# Altium project Akhrom V2.PrjPcb
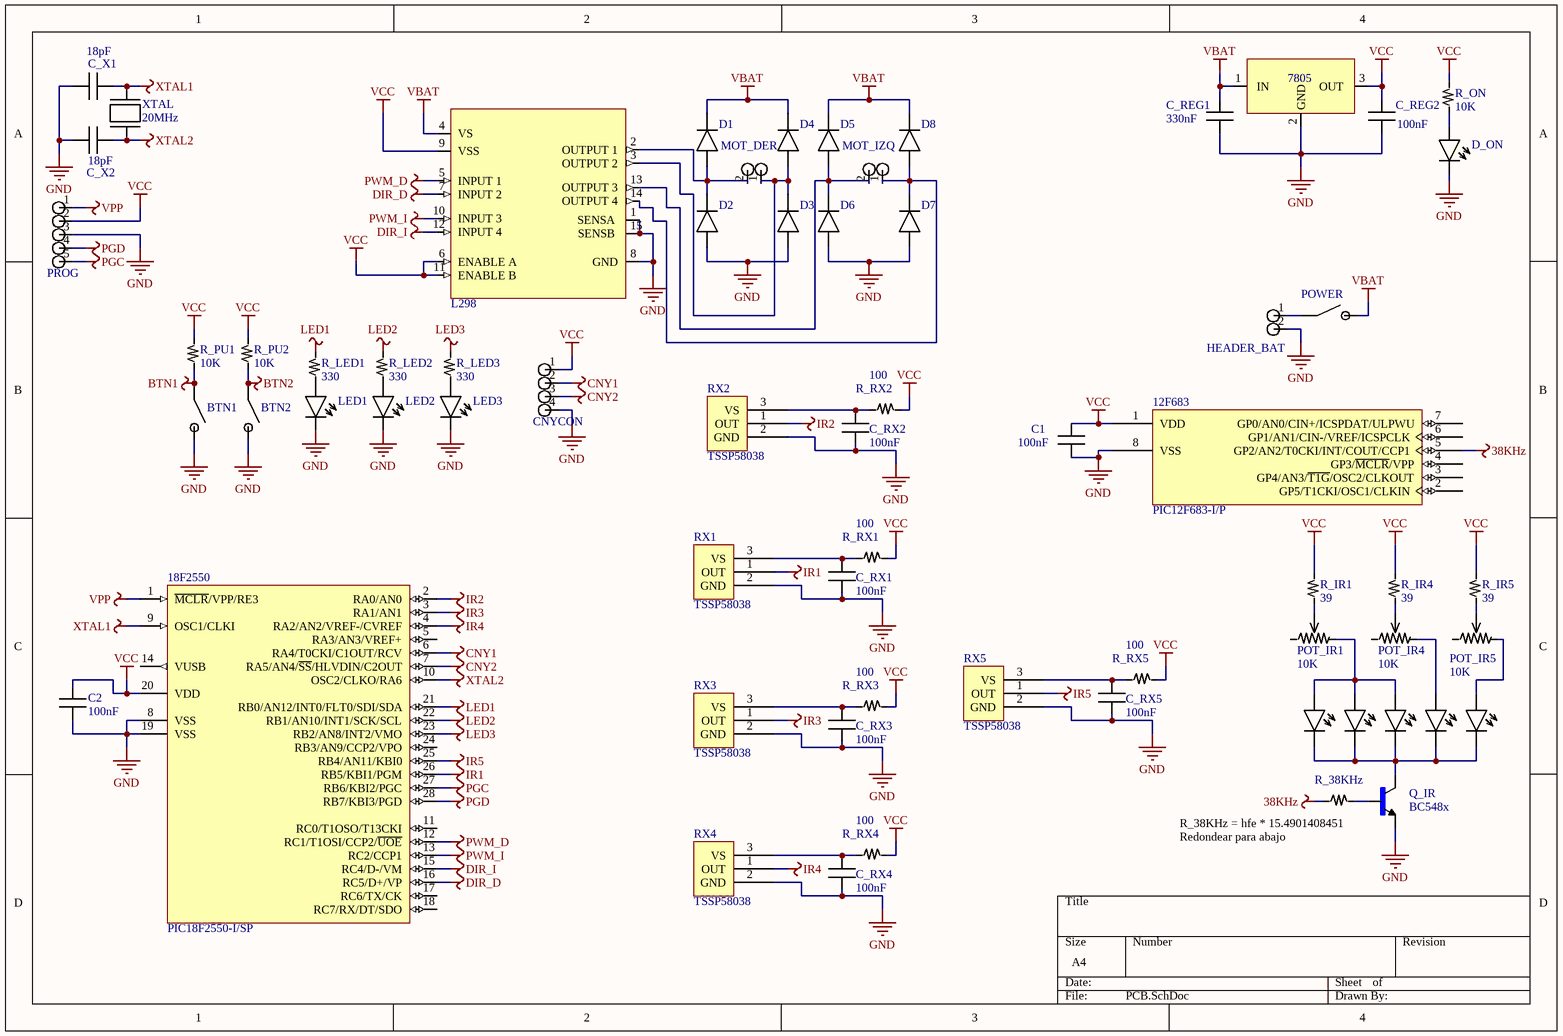
[diagram p0: PCB.SchDoc]
1 sheet, 65 parts. Net scope: global (net labels, ports and power ports of the same name join across sheets).
Board file: PCB.PcbDoc

## Sheet PCB.SchDoc
size A4

### Parts
12F683  PIC12F683-I/P  [PDIP300-P8]
18F2550  PIC18F2550-I/SP  [SPDIP300-SP28]
7805  LM7805  [TO-220-STRAIGHT]  (value not drawn)
BTN1  SWITCH  [TACT_SWITCH-SMALL-4PIN]  (value not drawn)
BTN2  SWITCH  [TACT_SWITCH-SMALL-4PIN]  (value not drawn)
C1  value 100nF  [CAP-CER]  (hidden comment: CAP-CER)
C2  value 100nF  [CAP-CER]  (hidden comment: CAP-CER)
C_REG1  value 330nF  [CAP-CER]  (hidden comment: CAP-CER)
C_REG2  value 100nF  [CAP-CER]  (hidden comment: CAP-CER)
C_RX1  value 100nF  [CAP-CER]  (hidden comment: CAP-CER)
C_RX2  value 100nF  [CAP-CER]  (hidden comment: CAP-CER)
C_RX3  value 100nF  [CAP-CER]  (hidden comment: CAP-CER)
C_RX4  value 100nF  [CAP-CER]  (hidden comment: CAP-CER)
C_RX5  value 100nF  [CAP-CER]  (hidden comment: CAP-CER)
C_X1  value 18pF  [CAP-CER]  (hidden comment: CAP-CER)
C_X2  value 18pF  [CAP-CER]  (hidden comment: CAP-CER)
CNYCON  HEADER-4  [HEADER-4-VERTICAL]  (value not drawn)
D1  (no value)  [DO-41]
D2  (no value)  [DO-41]
D3  (no value)  [DO-41]
D4  (no value)  [DO-41]
D5  (no value)  [DO-41]
D6  (no value)  [DO-41]
D7  (no value)  [DO-41]
D8  (no value)  [DO-41]
D_IR1  LED  [LED-3MM-YELLOW]  (value not drawn)
D_IR2  LED  [LED-3MM-YELLOW]  (value not drawn)
D_IR3  LED  [LED-3MM-YELLOW]  (value not drawn)
D_IR4  LED  [LED-3MM-YELLOW]  (value not drawn)
D_IR5  LED  [LED-3MM-YELLOW]  (value not drawn)
D_ON  LED  [LED-3MM-RED]  (value not drawn)
HEADER_BAT  HEADER-2  [HEADER-2-VERTICAL]  (value not drawn)
L298  L298  [Multiwatt15]  (value not drawn)
LED1  LED  [LED-3MM-RED]  (value not drawn)
LED2  LED  [LED-3MM-RED]  (value not drawn)
LED3  LED  [LED-3MM-RED]  (value not drawn)
MOT_DER  HEADER-2  [HEADER-2-VERTICAL]  (value not drawn)
MOT_IZQ  HEADER-2  [HEADER-2-VERTICAL]  (value not drawn)
POT_IR1  10K  [MULTITURN]
POT_IR4  10K  [MULTITURN]
POT_IR5  10K  [MULTITURN]
POWER  SWITCH  [ORT_SWITCH]  (value not drawn)
PROG  HEADER-5  [HEADER-5-VERTICAL]  (value not drawn)
Q_IR  BC548x  [TO92-EBC_BC548*(Primary)]
R_38KHz  RES  [RES-Axial-400mil]  (value not drawn)
R_IR1  value 39  [RES-Axial-400mil]  (hidden comment: RES)
R_IR4  value 39  [RES-Axial-400mil]  (hidden comment: RES)
R_IR5  value 39  [RES-Axial-400mil]  (hidden comment: RES)
R_LED1  value 330  [RES-Axial-400mil]  (hidden comment: RES)
R_LED2  value 330  [RES-Axial-400mil]  (hidden comment: RES)
R_LED3  value 330  [RES-Axial-400mil]  (hidden comment: RES)
R_ON  value 10K  [RES-Axial-400mil]  (hidden comment: RES)
R_PU1  value 10K  [RES-Axial-400mil]  (hidden comment: RES)
R_PU2  value 10K  [RES-Axial-400mil]  (hidden comment: RES)
R_RX1  value 100  [RES-Axial-400mil]  (hidden comment: RES)
R_RX2  value 100  [RES-Axial-400mil]  (hidden comment: RES)
R_RX3  value 100  [RES-Axial-400mil]  (hidden comment: RES)
R_RX4  value 100  [RES-Axial-400mil]  (hidden comment: RES)
R_RX5  value 100  [RES-Axial-400mil]  (hidden comment: RES)
RX1  TSSP58038  [TSSP58038]
RX2  TSSP58038  [TSSP58038]
RX3  TSSP58038  [TSSP58038]
RX4  TSSP58038  [TSSP58038]
RX5  TSSP58038  [TSSP58038]
XTAL  FREQUENCY: 20MHz  [HC-49/S]  (hidden comment: CRYSTAL-OSC)

### Nets
38KHz: 12F683.5(GP2/AN2/T0CKI/INT/COUT/CCP1) R_38KHz.2
BTN1: BTN1.1 R_PU1.2
BTN2: BTN2.1 R_PU2.2
CNY1: 18F2550.6(RA4/T0CKI/C1OUT/RCV) CNYCON.2
CNY2: 18F2550.7(RA5/AN4/~{SS}/HLVDIN/C2OUT) CNYCON.3
DIR_D: 18F2550.16(RC5/D+/VP) L298.7(INPUT_2)
DIR_I: 18F2550.15(RC4/D-/VM) L298.12(INPUT_4)
GND: 12F683.8(VSS) 18F2550.8(VSS) 18F2550.19(VSS) 7805.2(GND) BTN1.2 BTN2.2 C1.1 C2.1 C_REG1.1 C_REG2.1 C_RX1.2 C_RX2.2 C_RX3.2 C_RX4.2 C_RX5.2 C_X1.1 C_X2.1 CNYCON.4 D2.A D3.A D6.A D7.A D_ON.K HEADER_BAT.2 L298.1(SENSA) L298.8(GND) L298.15(SENSB) LED1.K LED2.K LED3.K PROG.3 Q_IR.E RX1.2(GND) RX2.2(GND) RX3.2(GND) RX4.2(GND) RX5.2(GND)
IR1: 18F2550.26(RB5/KBI1/PGM) RX1.1(OUT)
IR2: 18F2550.2(RA0/AN0) RX2.1(OUT)
IR3: 18F2550.3(RA1/AN1) RX3.1(OUT)
IR4: 18F2550.4(RA2/AN2/VREF-/CVREF) RX4.1(OUT)
IR5: 18F2550.25(RB4/AN11/KBI0) RX5.1(OUT)
LED1: 18F2550.21(RB0/AN12/INT0/FLT0/SDI/SDA) R_LED1.1
LED2: 18F2550.22(RB1/AN10/INT1/SCK/SCL) R_LED2.1
LED3: 18F2550.23(RB2/AN8/INT2/VMO) R_LED3.1
PGC: 18F2550.27(RB6/KBI2/PGC) PROG.5
PGD: 18F2550.28(RB7/KBI3/PGD) PROG.4
PWM_D: 18F2550.12(RC1/T1OSI/CCP2/~{UOE}) L298.5(INPUT_1)
PWM_I: 18F2550.13(RC2/CCP1) L298.10(INPUT_3)
VBAT: 7805.1(IN) C_REG1.2 D1.K D4.K D5.K D8.K L298.4(VS) POWER.2
VCC: 12F683.1(VDD) 18F2550.20(VDD) 7805.3(OUT) C1.2 C2.2 C_REG2.2 CNYCON.1 L298.6(ENABLE_A) L298.9(VSS) L298.11(ENABLE_B) PROG.2 R_IR1.1 R_IR4.1 R_IR5.1 R_ON.1 R_PU1.1 R_PU2.1 R_RX1.1 R_RX2.1 R_RX3.1 R_RX4.1 R_RX5.1
VPP: 18F2550.1(~{MCLR}/VPP/RE3) PROG.1
XTAL1: 18F2550.9(OSC1/CLKI) C_X1.2 XTAL.2
XTAL2: 18F2550.10(OSC2/CLKO/RA6) C_X2.2 XTAL.1
NetC_RX1_1: C_RX1.1 R_RX1.2 RX1.3(VS)
NetC_RX2_1: C_RX2.1 R_RX2.2 RX2.3(VS)
NetC_RX3_1: C_RX3.1 R_RX3.2 RX3.3(VS)
NetC_RX4_1: C_RX4.1 R_RX4.2 RX4.3(VS)
NetC_RX5_1: C_RX5.1 R_RX5.2 RX5.3(VS)
NetD1_A: D1.A D2.K L298.2(OUTPUT_1) MOT_DER.2
NetD3_K: D3.K D4.A L298.3(OUTPUT_2) MOT_DER.1
NetD5_A: D5.A D6.K L298.13(OUTPUT_3) MOT_IZQ.2
NetD7_K: D7.K D8.A L298.14(OUTPUT_4) MOT_IZQ.1
NetD_IR1_A: D_IR1.A D_IR2.A D_IR3.A POT_IR1.3
NetD_IR1_K: D_IR1.K D_IR2.K D_IR3.K D_IR4.K D_IR5.K Q_IR.C
NetD_IR4_A: D_IR4.A POT_IR4.3
NetD_IR5_A: D_IR5.A POT_IR5.3
NetD_ON_A: D_ON.A R_ON.2
NetHEADER_BAT_1: HEADER_BAT.1 POWER.1
NetLED1_A: LED1.A R_LED1.2
NetLED2_A: LED2.A R_LED2.2
NetLED3_A: LED3.A R_LED3.2
NetPOT_IR1_2: POT_IR1.2 R_IR1.2
NetPOT_IR4_2: POT_IR4.2 R_IR4.2
NetPOT_IR5_2: POT_IR5.2 R_IR5.2
NetQ_IR_B: Q_IR.B R_38KHz.1

Not connected (* = marked no-connect by the designer): 12F683 2(GP5/T1CKI/OSC1/CLKIN) 3(GP4/AN3/~{T1G}/OSC2/CLKOUT) 4(GP3/~{MCLR}/VPP) 6(GP1/AN1/CIN-/VREF/ICSPCLK) 7(GP0/AN0/CIN+/ICSPDAT/ULPWU); 18F2550 5(RA3/AN3/VREF+) 11(RC0/T1OSO/T13CKI) 14(VUSB) 17(RC6/TX/CK) 18(RC7/RX/DT/SDO) 24(RB3/AN9/CCP2/VPO); POT_IR1 1; POT_IR4 1; POT_IR5 1

### Notes on the sheet
- (near R_38KHz) R_38KHz = hfe * 15.4901408451
  Redondear para abajo

### Library data of the parts
12F683 = PIC12F683-I/P: Flash-Based 8-Bit CMOS Microcontroller with nanoWatt Technology, 2K (x14-Bit words) Program Memory, 384 Bytes Data Memory, 8-Pin PDIP, Industrial Temperature; Published: 29-Jan-2009; LatestRevisionDate: 02-Dec-2009; LatestRevisionNote: Updated to datasheet revision revD, Feb-2007.; DatasheetVersion: revD, Feb-2007; PackageVersion: revBB, Aug-2009; PackageReference: PDIP300-P8; Publisher: Altium Limited; PackageDescription: 8-Lead Plastic Dual In-Line (P) - 300 mil Body [PDIP]; Supplier 1: Digi-Key; Supplier Part Number 1: PIC12F683-I/P-ND; Supplier 2: Farnell; Supplier Part Number 2: 9759034; Supplier 3: Farnell; Supplier Part Number 3: 1523923; Code_JEDEC: MS-001; ComponentLink1Description: Datasheet; ComponentLink1URL: http://ww1.microchip.com/downloads/en/DeviceDoc/41211D_.pdf; ComponentLink2Description: Packaging Specification; ComponentLink2URL: http://www.microchip.com/stellent/groups/techpub_sg/documents/packagingspec/en012702.pdf; ComponentLink3Description: Microchip.com Home; ComponentLink3URL: http://www.microchip.com/
18F2550 = PIC18F2550-I/SP: High Performance, Enhanced Flash, USB Microcontroller with nanoWatt Technology, 32K Flash, 28-Pin SPDIP, Industrial Temperature Range; Published: 29-Jan-2009; LatestRevisionDate: 02-Dec-2009; LatestRevisionNote: Updated to datasheet revision E, Aug-2008; DatasheetVersion: revE, Aug-2008; PackageVersion: revBB, Aug-2009; PackageReference: SPDIP300-SP28; Publisher: Altium Limited; PackageDescription: 28-Lead Skinny Plastic Dual In-Line (SP) - 300 mil Body [SPDIP]; Supplier 1: Digi-Key; Supplier Part Number 1: PIC18F2550-I/SP-ND; Supplier 2: Farnell; Supplier Part Number 2: 9321250; Supplier 3: Farnell; Supplier Part Number 3: 1523822; ComponentLink1Description: Datasheet; ComponentLink1URL: http://ww1.microchip.com/downloads/en/DeviceDoc/39632e.pdf; ComponentLink2Description: Packaging Specification; ComponentLink2URL: http://www.microchip.com/stellent/groups/techpub_sg/documents/packagingspec/en012702.pdf; ComponentLink3Description: Microchip.com Home; ComponentLink3URL: http://www.microchip.com/
D1-D8 = DIODE
POT_IR1 POT_IR4 POT_IR5 = POT
Q_IR = BC548*: Transistor Silicon Npn Ambient Rated To D3007, Bc5; MP: BC548; MF: NXP Semiconductors; Price: 0.03 USD; Package: TO-92 NXP Semiconductors; Availability: Unavailable; Value: *
R_38KHz = RES: VALUE: 10K